# EAGLE schematic Diagrama-Eduproto (EAGLE 8.3.2)
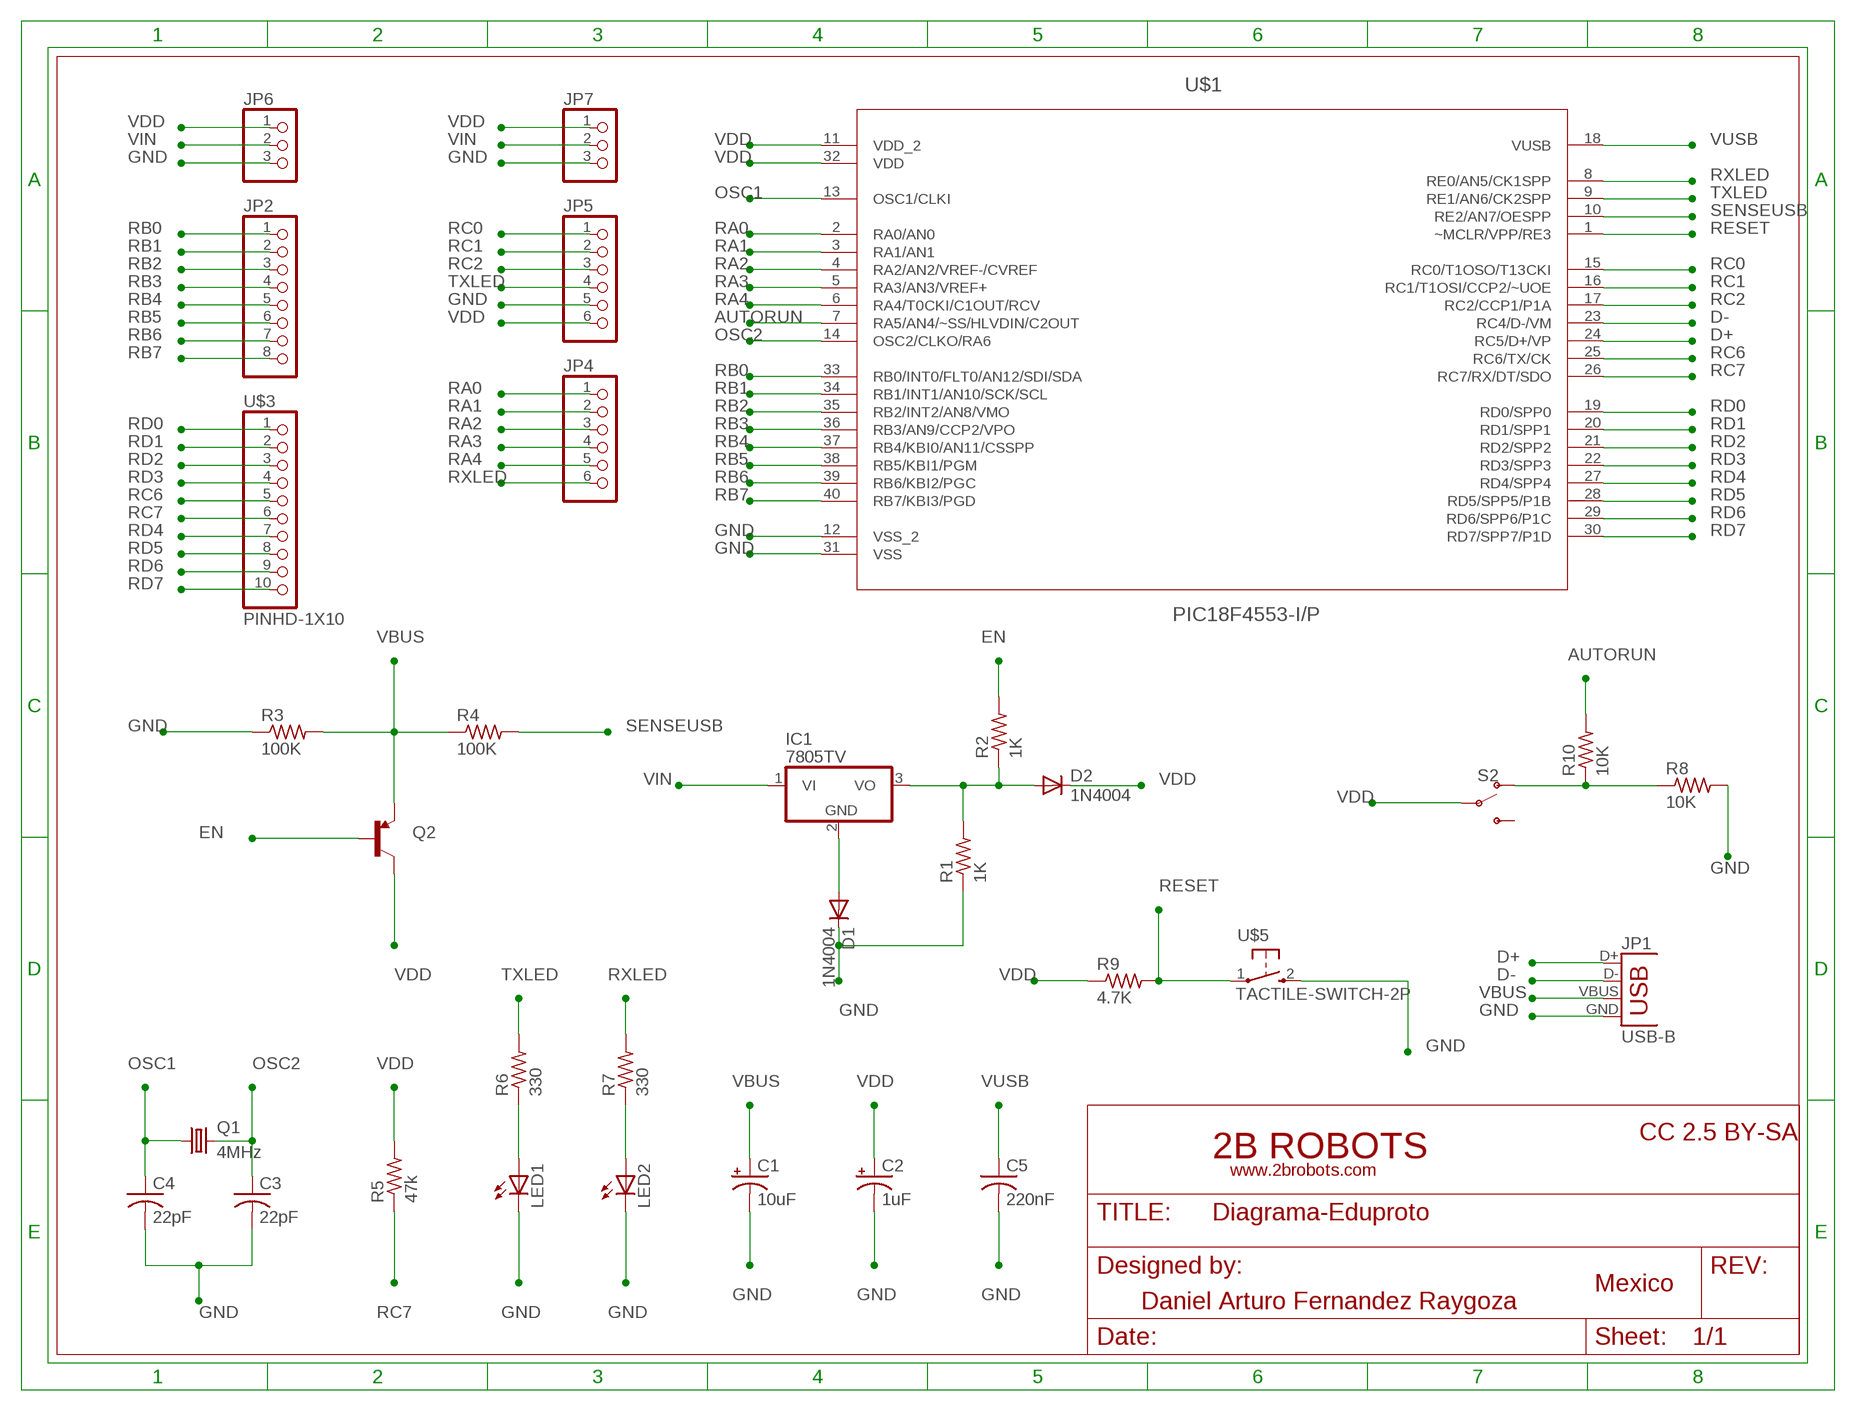
[diagram p0: schematic, sheet 1]

## Parts
C1  10uF  CPOL-USE1.8-4  [E1,8-4]
C2  1uF  CPOL-USE1.8-4  [E1,8-4]
C3  22pF  C-US050-024X044  [C050-024X044]
C4  22pF  C-US050-024X044  [C050-024X044]
C5  220nF  C-US050-025X075  [C050-025X075]
D1  1N4004  [DO41-10]
D2  1N4004  [DO41-10]
IC1  7805TV  [TO220V]
JP1  USB-B  USBPTH  [USB-B-PTH]
JP2  PINHD-1X8BIG  [1X08-BIG]
JP4  PINHD-1X6B  [1X06-BIG]
JP5  PINHD-1X6B  [1X06-BIG]
JP6  PINHD-1X3CB  [1X03-CLEANBIG]
JP7  PINHD-1X3CB  [1X03-CLEANBIG]
LED1  LED5MM  [LED5MM]
LED2  LED5MM  [LED5MM]
Q1  4MHz  CRYSTALHC49S  [HC49/S]
Q2  TRANSISTOR_PNPTO92  [TO-92]
R1  1K  R-US_0207/10  [0207/10]
R2  1K  R-US_0207/10  [0207/10]
R3  100K  R-US_0207/10  [0207/10]
R4  100K  R-US_0207/10  [0207/10]
R5  47k  R-US_0207/10  [0207/10]
R6  330  R-US_0207/10  [0207/10]
R7  330  R-US_0207/10  [0207/10]
R8  10K  R-US_0207/10  [0207/10]
R9  4.7K  R-US_0207/10  [0207/10]
R10  10K  R-US_0207/10  [0207/10]
S2  SWITCH-SPDT-PTH-11.6X4.0MM  [SWITCH_SPDT_PTH_11.6X4.0MM]
U$1  PIC18F4553-I/P  [DIP254P1524X635-40]
U$3  PINHD-1X10  [1X10-BIG]
U$5  TACTILE-SWITCH-2P  [TAC-SWITCH-PTH-2P]

## Nets
AUTORUN: R10.2 U$1.7(RA5/AN4/~SS/HLVDIN/C2OUT)
D+: JP1.D+ U$1.24(RC5/D+/VP)
D-: JP1.D- U$1.23(RC4/D-/VM)
EN: Q2.2(B) R2.2
GND: C1.- C2.- C3.2 C4.2 C5.2 D1.C JP1.GND JP5.5 JP6.3 JP7.3 LED1.K(C) LED2.K(C) R1.1 R3.1 R8.2 U$1.12(VSS_2) U$1.31(VSS) U$5.2
N$2: D1.A IC1.2(GND)
N$3: R8.1 R10.1 S2.1(O)
N$4: D2.A IC1.3(VO) R1.2 R2.1
N$11: LED1.A R6.1
N$12: LED2.A R7.1
OSC1: C4.1 Q1.1 U$1.13(OSC1/CLKI)
OSC2: C3.1 Q1.2 U$1.14(OSC2/CLKO/RA6)
RA0: JP4.1 U$1.2(RA0/AN0)
RA1: JP4.2 U$1.3(RA1/AN1)
RA2: JP4.3 U$1.4(RA2/AN2/VREF-/CVREF)
RA3: JP4.4 U$1.5(RA3/AN3/VREF+)
RA4: JP4.5 U$1.6(RA4/T0CKI/C1OUT/RCV)
RB0: JP2.1 U$1.33(RB0/INT0/FLT0/AN12/SDI/SDA)
RB1: JP2.2 U$1.34(RB1/INT1/AN10/SCK/SCL)
RB2: JP2.3 U$1.35(RB2/INT2/AN8/VMO)
RB3: JP2.4 U$1.36(RB3/AN9/CCP2/VPO)
RB4: JP2.5 U$1.37(RB4/KBI0/AN11/CSSPP)
RB5: JP2.6 U$1.38(RB5/KBI1/PGM)
RB6: JP2.7 U$1.39(RB6/KBI2/PGC)
RB7: JP2.8 U$1.40(RB7/KBI3/PGD)
RC0: JP5.1 U$1.15(RC0/T1OSO/T13CKI)
RC1: JP5.2 U$1.16(RC1/T1OSI/CCP2/~UOE)
RC2: JP5.3 U$1.17(RC2/CCP1/P1A)
RC6: U$1.25(RC6/TX/CK) U$3.5
RC7: R5.1 U$1.26(RC7/RX/DT/SDO) U$3.6
RD0: U$1.19(RD0/SPP0) U$3.1
RD1: U$1.20(RD1/SPP1) U$3.2
RD2: U$1.21(RD2/SPP2) U$3.3
RD3: U$1.22(RD3/SPP3) U$3.4
RD4: U$1.27(RD4/SPP4) U$3.7
RD5: U$1.28(RD5/SPP5/P1B) U$3.8
RD6: U$1.29(RD6/SPP6/P1C) U$3.9
RD7: U$1.30(RD7/SPP7/P1D) U$3.10
RESET: R9.2 U$1.1(~MCLR/VPP/RE3) U$5.1
RXLED: JP4.6 R7.2 U$1.8(RE0/AN5/CK1SPP)
SENSEUSB: R4.2 U$1.10(RE2/AN7/OESPP)
TXLED: JP5.4 R6.2 U$1.9(RE1/AN6/CK2SPP)
VBUS: C1.+ JP1.VBUS Q2.1(E) R3.2 R4.1
VDD: C2.+ D2.C JP5.6 JP6.1 JP7.1 Q2.3(C) R5.2 R9.1 S2.2(P) U$1.11(VDD_2) U$1.32(VDD)
VIN: IC1.1(VI) JP6.2 JP7.2
VUSB: C5.1 U$1.18(VUSB)
Unconnected: S2.3(S)

## Library data of the parts
C1 C2 = adafruit:CPOL-US: POLARIZED CAPACITOR, American symbol
C3-C5 = adafruit:C-US: CAPACITOR, American symbol
D1 D2 = adafruit:1N4004: DIODE General purpose 1N400x type rectifier (With bigger pads) http://www.ladyada.net/library/pcb/eaglelibrary.html
IC1 = linear:78*: Positive VOLTAGE REGULATOR Source: http://cache.national.com/ds/LM/LM78L05.pdf http://www.fairchildsemi.com/ds/LM/LM7805.pdf
JP1 = SparkFun-Connectors:USB: USB Connectors USB-B-PTH is fully proven SKU : PRT-00139/CONN-08278 USB-miniB is fully proven SKU : PRT-00587 USB-A-PCB is untested. USB-A-H is throughly reviewed, but untested. Spark Fun Electronics SKU : PRT-00437 USB-B-SMT is throughly reviewed, but untested. Needs silkscreen touching up. USB-A-S has not been used/tested USB-MB-H has not been used/tested USB-MICROB has been used. CONN-09505; PROD_ID: CONN-08278
JP2 = adafruit:PINHD-1X8: PIN HEADER
JP4 JP5 = adafruit:PINHD-1X6: PIN HEADER
JP6 JP7 = adafruit:PINHD-1X3: PIN HEADER
LED1 LED2 = adafruit:LED: LED OSRAM: - CHIPLED LG R971, LG N971, LY N971, LG Q971, LY Q971, LO R971, LY R971 LH N974, LH R974 LS Q976, LO Q976, LY Q976 LO Q996 - Hyper CHIPLED LW Q18S LB Q993, LB Q99A, LB R99A - SideLED LS A670, LO A670, LY A670, LG A670, LP A670 LB A673, LV A673, LT A673, LW A673 LH A674 LY A675 LS A676, LA A676, LO A676, LY A676, LW A676 LS A679, LY A679, LG A679 - Hyper Micro SIDELED® LS Y876, LA Y876, LO Y876, LY Y876 LT Y87S - SmartLED LW L88C, LW L88S LB L89C, LB L89S, LG L890 LS L89K, LO L89K, LY L89K LS L896, LA L896, LO L896, LY L896 - TOPLED LS T670, LO T670, LY T670, LG T670, LP T670 LSG T670, LSP T670, LSY T670, LOP T670, LYG T670 LG T671, LOG T671, LSG T671 LB T673, LV T673, LT T673, LW T673 LH T674 LS T676, LA T676, LO T676, LY T676, LB T676, LH T676, LSB T676, LW T676 LB T67C, LV T67C, LT T67C, LS T67K, LO T67K, LY T67K, LW E67C LS E67B, LA E67B, LO E67B, LY E67B, LB E67C, LV E67C, LT E67C LW T67C LS T679, LY T679, LG T679 LS T770, LO T770, LY T770, LG T770, LP T770 LB T773, LV T773, LT T773, LW T773 LH T774 LS E675, LA E675, LY E675, LS T675 LS T776, LA T776, LO T776, LY T776, LB T776 LHGB T686 LT T68C, LB T68C - Hyper Mini TOPLED® LB M676 - Mini TOPLED Santana® LG M470 LS M47K, LO M47K, LY M47K Source: http://www.osram.convergy.de/
Q1 = adafruit:CRYSTAL: CRYSTAL; OC_FARNELL: 1667008; OC_NEWARK: unknown
Q2 = SparkFun-DiscreteSemi:TRANSISTOR_PNP: Generic PNP BJT Double check pinouts against datasheets- not all devices are the same! MMBT3906 - 40V 200mA SOT-23 (TRANS-08052) MMBT4403 - 40V 600mA SOT-23 (TRANS-09245)
R1-R10 = adafruit:R-US_: RESISTOR, American symbol
S2 = SparkFun-Switches:SWITCH-SPDT: Single Pole, Double Throw (SPDT) Switch Single-pole, double-throw (SPDT) switch. Variant Overview SMD-AYZ0202 Surface Mount DPDT Switch <https://www.sparkfun.com/products/597> (COM-00597) Used on e.g. LilyPad Arduino USB - ATmega32U4 Board <https://www.sparkfun.com/products/12049> PTH-11.6X4.0MM SPDT Mini Power Switch <https://www.sparkfun.com/products/102> (COM-00102) Used on e.g. SparkFun Simon Says - Through-Hole Soldering Kit <https://www.sparkfun.com/products/10547> (KIT-10547) PTH-11.6X4.0MM-KIT KIT version of SPDT Mini Power Switch - Simplifies soldering by removing tStop of switch pins - only one side can be soldered. PTH-11.6X4.0MM-LOCK LOCK version of SPDT Mini Power Switch - Offset pins hold switch in place for easier soldering. SMD-RIGHT-ANGLE Surface Mount Right Angle Switch <https://www.sparkfun.com/products/10860> (COM-10860) Used on e.g. SparkFun ESP8266 Thing <https://www.sparkfun.com/products/13231>; PROD_ID: SWCH-08261; SF_SKU: COM-00102
U$1 = PIC 18F4553:PIC18F4553-I/P: USB Microcontrollers; DESCRIPTION: USB Microcontrollers; MPN: PIC18F4553-I/P; OC_FARNELL: 1579608; OC_NEWARK: 54M5025; PACKAGE: DIP-40; SUPPLIER: Microchip
U$3 = adafruit:PINHD-1X10: Pin header 1x10 0.1" spacing With round pins
U$5 = GeekAmmo:TACTILE-SWITCH-2P